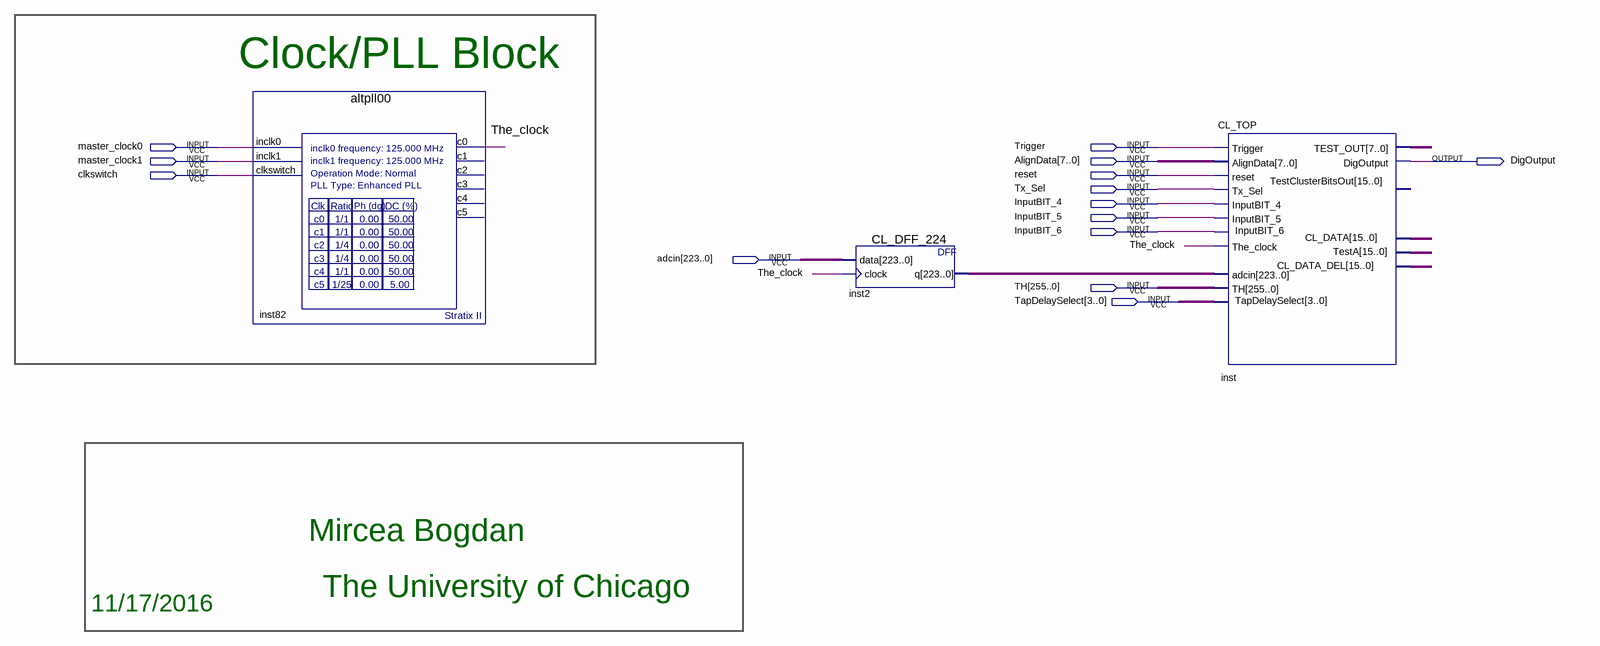
[diagram p0: schematic sheet]
// Quartus schematic sigma_delta.bdf as structural Verilog: 3 symbols, 14 pins
module sigma_delta (
  input  master_clock0,
  input  Trigger,
  input  master_clock1,
  input  [7:0] AlignData,
  input  clkswitch,
  input  reset,
  input  Tx_Sel,
  input  InputBIT_4,
  input  InputBIT_5,
  input  InputBIT_6,
  input  [223:0] adcin,
  input  [255:0] TH,
  input  [3:0] TapDelaySelect,
  output DigOutput
);

  wire The_clock;
  wire [7:0] inst_test_out;
  wire [15:0] inst_cl_data, inst_cl_data_del, inst_testa;
  wire [223:0] inst2_q;

  altpll00 inst82 (
    .inclk0(master_clock0), .inclk1(master_clock1), .clkswitch(clkswitch), .c0(The_clock));  // open: c1, c2, c3, c4, c5
  CL_DFF_224 inst2 (.data(adcin), .clock(The_clock), .q(inst2_q));
  CL_TOP inst (
    .Trigger(Trigger), .AlignData(AlignData), .reset(reset), .Tx_Sel(Tx_Sel), .InputBIT_4(InputBIT_4),
    .InputBIT_5(InputBIT_5), .The_clock(The_clock), .adcin(inst2_q), .TH(TH), .InputBIT_6(InputBIT_6),
    .TapDelaySelect(TapDelaySelect), .TEST_OUT(inst_test_out), .DigOutput(DigOutput), .CL_DATA(inst_cl_data),
    .TestA(inst_testa), .CL_DATA_DEL(inst_cl_data_del));  // open: TestClusterBitsOut

  // Notes on the sheet:
  //   Clock/PLL Block
  //   Mircea Bogdan
  //   The University of Chicago
  //   11/17/2016
endmodule
